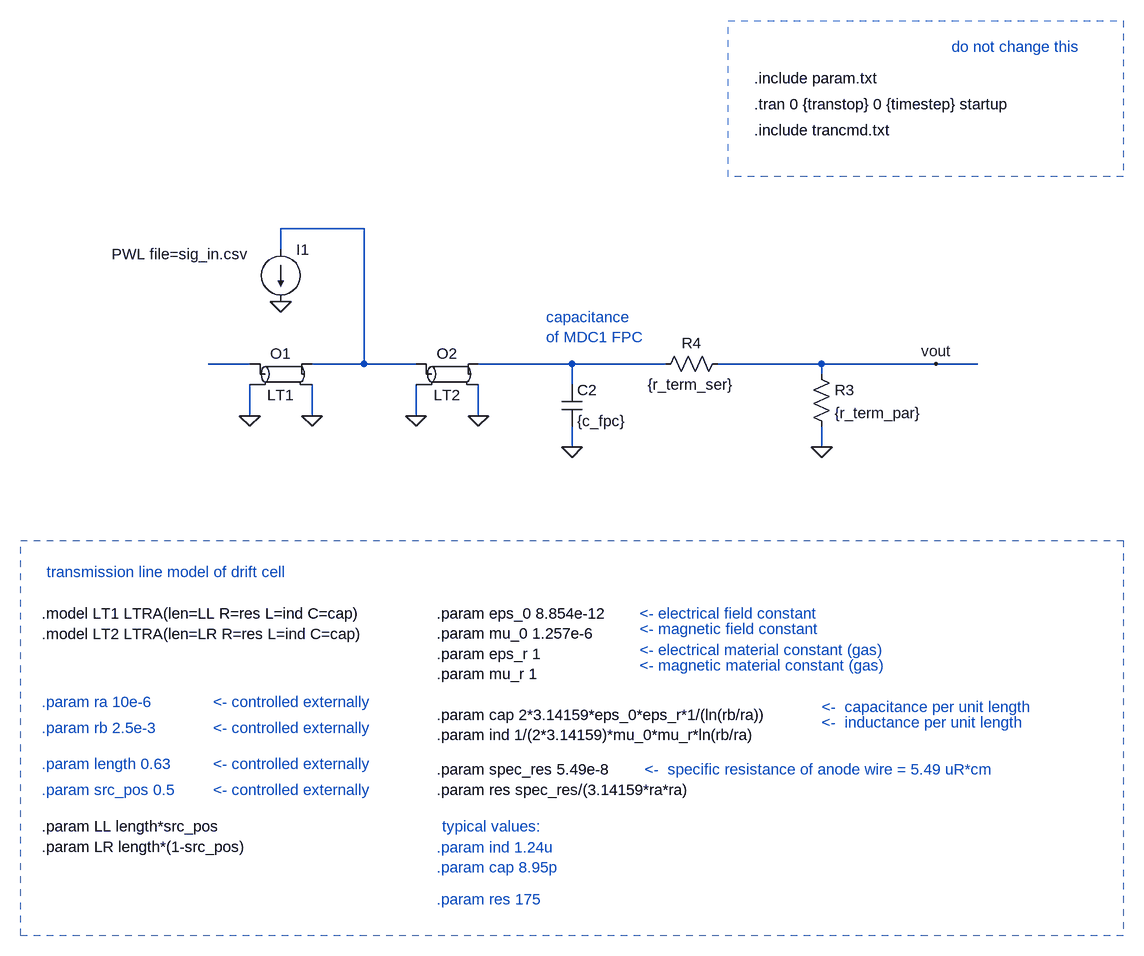
[diagram p0: schematic tline_model.asc]
tline_model.asc, the LTspice schematic file:
Version 4
SHEET 1 3204 1444
WIRE 2032 352 1904 352
WIRE 1904 384 1904 352
WIRE 1856 560 1792 560
WIRE 2032 560 2032 352
WIRE 2032 560 1952 560
WIRE 2112 560 2032 560
WIRE 2352 560 2208 560
WIRE 2496 560 2352 560
WIRE 2736 560 2576 560
WIRE 2912 560 2736 560
WIRE 2976 560 2912 560
WIRE 2736 576 2736 560
WIRE 2352 592 2352 560
WIRE 1856 640 1856 592
WIRE 1952 640 1952 592
WIRE 2112 640 2112 592
WIRE 2208 640 2208 592
WIRE 2352 688 2352 656
WIRE 2736 688 2736 656
FLAG 2912 560 vout
FLAG 1904 464 0
FLAG 2736 688 0
FLAG 2208 640 0
FLAG 2112 640 0
FLAG 1952 640 0
FLAG 1856 640 0
FLAG 2352 688 0
SYMBOL res 2720 560 R0
SYMATTR InstName R3
SYMATTR Value {r_term_par}
SYMBOL res 2592 544 R90
WINDOW 0 0 56 VBottom 2
WINDOW 3 32 56 VTop 2
SYMATTR InstName R4
SYMATTR Value {r_term_ser}
SYMBOL cap 2336 592 R0
SYMATTR InstName C2
SYMATTR Value {c_fpc}
SYMBOL ltline 1904 576 R0
SYMATTR InstName O1
SYMATTR Value LT1
SYMBOL ltline 2160 576 R0
SYMATTR InstName O2
SYMATTR Value LT2
SYMBOL current 1904 384 R0
WINDOW 3 -260 7 Left 2
SYMATTR Value PWL file=sig_in.csv
SYMATTR InstName I1
TEXT 2632 160 Left 2 !.tran 0 {transtop} 0 {timestep} startup
TEXT 2632 120 Left 2 !.include param.txt
TEXT 2632 200 Left 2 !.include trancmd.txt
TEXT 1536 1176 Left 2 ;.param length 0.63
TEXT 1536 976 Left 2 !.model LT2 LTRA(len=LR R=res L=ind C=cap)
TEXT 1536 1216 Left 2 ;.param src_pos 0.5
TEXT 2144 1304 Left 2 ;.param ind 1.24u\n.param cap 8.95p
TEXT 1536 944 Left 2 !.model LT1 LTRA(len=LL R=res L=ind C=cap)
TEXT 1536 1272 Left 2 !.param LL length*src_pos\n.param LR length*(1-src_pos)
TEXT 2144 1384 Left 2 ;.param res 175
TEXT 2312 488 Left 2 ;capacitance \nof MDC1 FPC
TEXT 1544 880 Left 2 ;transmission line model of drift cell
TEXT 1800 1176 Left 2 ;<- controlled externally
TEXT 1800 1216 Left 2 ;<- controlled externally
TEXT 2144 944 Left 2 !.param eps_0 8.854e-12 \n.param mu_0 1.257e-6 \n.param eps_r 1 \n.param mu_r 1 \n \n.param cap 2*3.14159*eps_0*eps_r*1/(ln(rb/ra))\n.param ind 1/(2*3.14159)*mu_0*mu_r*ln(rb/ra)
TEXT 2456 944 Left 2 ;<- electrical field constant
TEXT 2456 968 Left 2 ;<- magnetic field constant
TEXT 2456 1000 Left 2 ;<- electrical material constant (gas)
TEXT 2456 1024 Left 2 ;<- magnetic material constant (gas)
TEXT 2736 1088 Left 2 ;<-  capacitance per unit length
TEXT 2736 1112 Left 2 ;<-  inductance per unit length
TEXT 2144 1216 Left 2 !.param res spec_res/(3.14159*ra*ra)
TEXT 2144 1184 Left 2 !.param spec_res 5.49e-8
TEXT 2464 1184 Left 2 ;<-  specific resistance of anode wire = 5.49 uR*cm
TEXT 2152 1272 Left 2 ;typical values:
TEXT 1536 1080 Left 2 ;.param ra 10e-6
TEXT 1536 1120 Left 2 ;.param rb 2.5e-3
TEXT 1800 1080 Left 2 ;<- controlled externally
TEXT 1800 1120 Left 2 ;<- controlled externally
TEXT 2936 72 Left 2 ;do not change this
RECTANGLE Normal 1504 832 3200 1440 2
RECTANGLE Normal 3200 272 2592 32 2

The netlist it stands for:
* tline_model.asc
R3 vout 0 {r_term_par}
R4 vout N003 {r_term_ser}
C2 N003 0 {c_fpc}
O1 N002 0 N001 0 LT1
O2 N001 0 N003 0 LT2
I1 N001 0 PWL file=sig_in.csv
.tran 0 {transtop} 0 {timestep} startup
.include param.txt
.include trancmd.txt
* .param length 0.63
.model LT2 LTRA(len=LR R=res L=ind C=cap)
* .param src_pos 0.5
* .param ind 1.24u
* .param cap 8.95p
.model LT1 LTRA(len=LL R=res L=ind C=cap)
.param LL length*src_pos
.param LR length*(1-src_pos)
* .param res 175
* capacitance
* of MDC1 FPC
* transmission line model of drift cell
* <- controlled externally
* <- controlled externally
.param eps_0 8.854e-12
.param mu_0 1.257e-6
.param eps_r 1
.param mu_r 1
.param cap 2*3.14159*eps_0*eps_r*1/(ln(rb/ra))
.param ind 1/(2*3.14159)*mu_0*mu_r*ln(rb/ra)
* <- electrical field constant
* <- magnetic field constant
* <- electrical material constant (gas)
* <- magnetic material constant (gas)
* <-  capacitance per unit length
* <-  inductance per unit length
.param res spec_res/(3.14159*ra*ra)
.param spec_res 5.49e-8
* <-  specific resistance of anode wire = 5.49 uR*cm
* typical values:
* .param ra 10e-6
* .param rb 2.5e-3
* <- controlled externally
* <- controlled externally
* do not change this
.backanno
.end